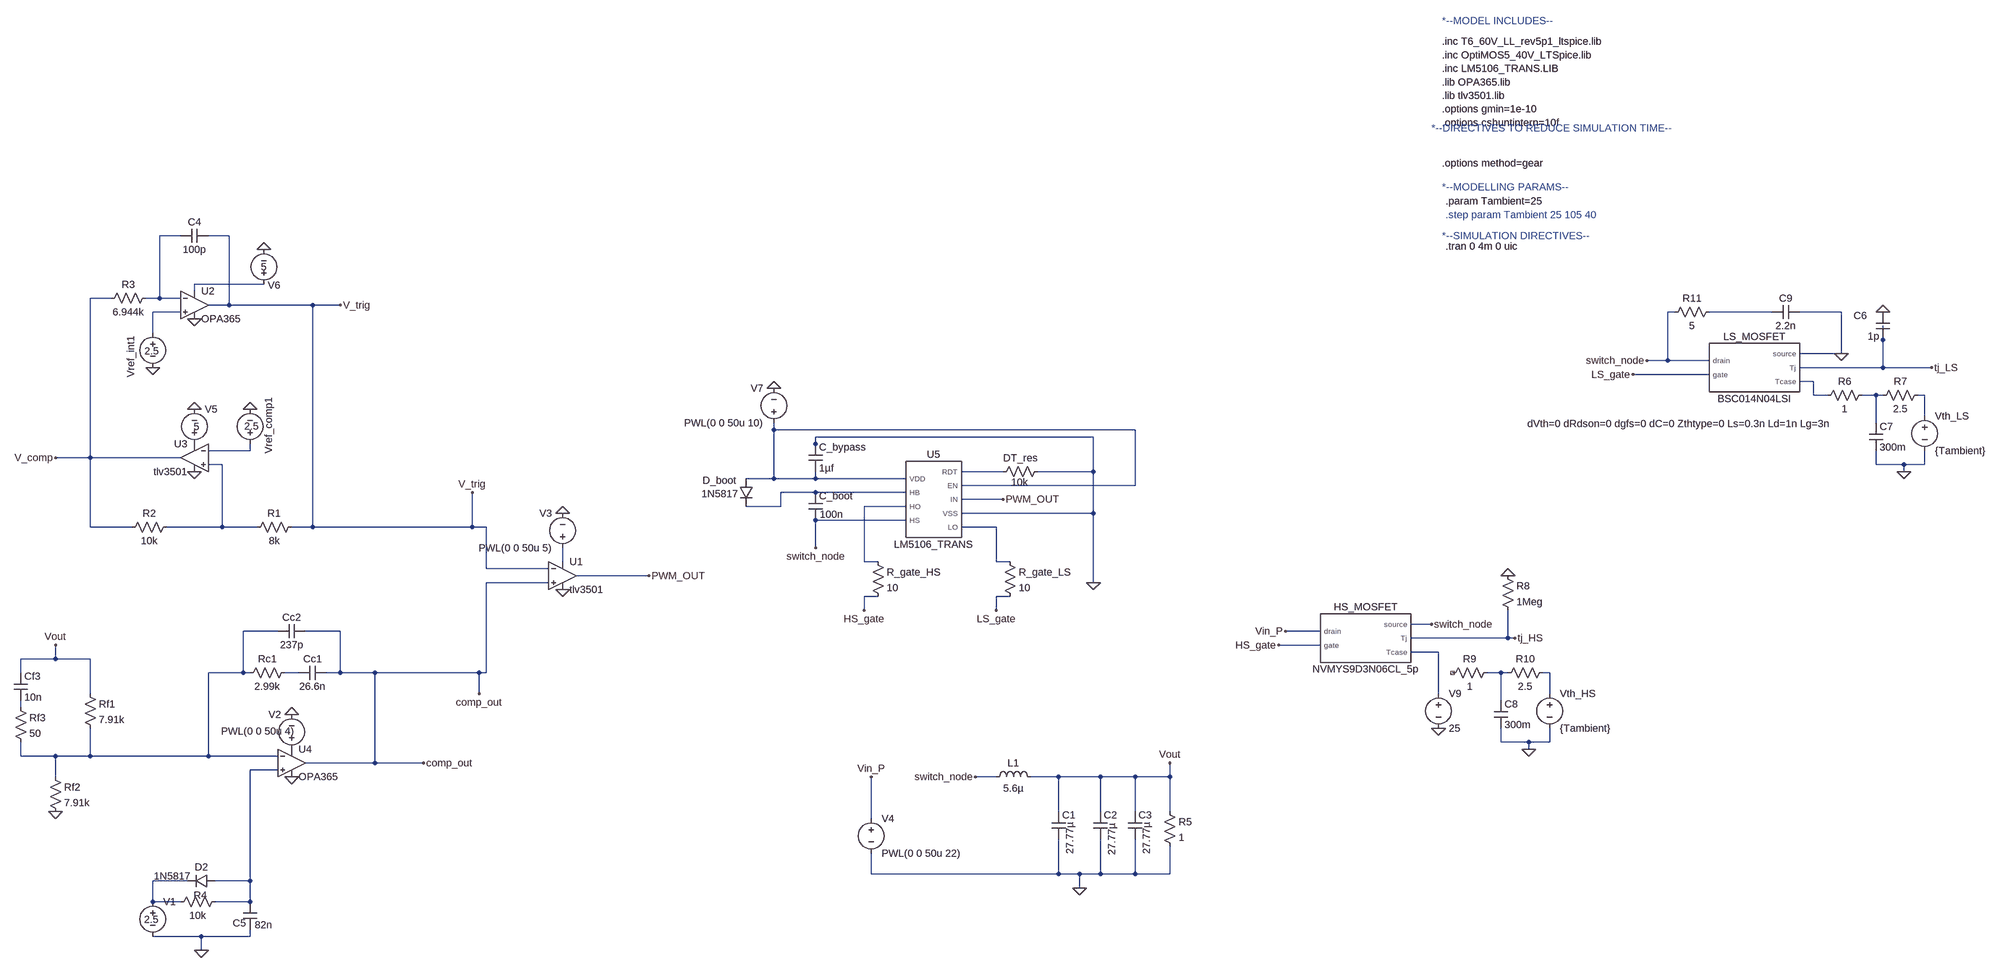
[diagram p0: schematic Full_model.asc]
Full_model.asc, the LTspice schematic file:
Version 4.1
SHEET 1 3588 1124
WIRE -784 -560 -832 -560
WIRE -672 -560 -720 -560
WIRE -592 -448 -752 -448
WIRE -752 -432 -752 -448
WIRE -944 -416 -992 -416
WIRE -832 -416 -832 -560
WIRE -832 -416 -864 -416
WIRE -784 -416 -832 -416
WIRE -672 -400 -672 -560
WIRE -672 -400 -720 -400
WIRE -480 -400 -672 -400
WIRE -416 -400 -480 -400
WIRE -784 -384 -848 -384
WIRE 2848 -384 2832 -384
WIRE 3072 -384 2928 -384
WIRE 3232 -384 3136 -384
WIRE -848 -336 -848 -384
WIRE 3328 -320 3328 -352
WIRE 3232 -288 3232 -384
WIRE 3232 -288 3136 -288
WIRE 2832 -272 2832 -384
WIRE 2832 -272 2784 -272
WIRE 2928 -272 2832 -272
WIRE 3328 -256 3328 -320
WIRE 3328 -256 3136 -256
WIRE 3440 -256 3328 -256
WIRE 2928 -240 2752 -240
WIRE 3168 -224 3136 -224
WIRE 3168 -192 3168 -224
WIRE 3200 -192 3168 -192
WIRE 3312 -192 3280 -192
WIRE 3328 -192 3312 -192
WIRE 3424 -192 3408 -192
WIRE 3424 -144 3424 -192
WIRE 3312 -128 3312 -192
WIRE 608 -112 608 -128
WIRE 1440 -112 608 -112
WIRE 1344 -96 704 -96
WIRE 704 -80 704 -96
WIRE -624 -64 -624 -80
WIRE -624 -64 -720 -64
WIRE 704 -64 704 -80
WIRE -992 -48 -992 -416
WIRE -992 -48 -1072 -48
WIRE -784 -48 -992 -48
WIRE -688 -32 -720 -32
WIRE 3312 -32 3312 -64
WIRE 3376 -32 3312 -32
WIRE 3424 -32 3424 -64
WIRE 3424 -32 3376 -32
WIRE 1136 -16 1040 -16
WIRE 1344 -16 1344 -96
WIRE 1344 -16 1216 -16
WIRE 3376 -16 3376 -32
WIRE 608 0 608 -112
WIRE 608 0 544 0
WIRE 704 0 704 -16
WIRE 704 0 608 0
WIRE 912 0 704 0
WIRE 1440 16 1440 -112
WIRE 1440 16 1040 16
WIRE 704 32 624 32
WIRE 912 32 704 32
WIRE 1136 48 1040 48
WIRE 624 64 624 32
WIRE 624 64 544 64
WIRE 912 64 816 64
WIRE 1344 80 1344 -16
WIRE 1344 80 1040 80
WIRE 912 96 704 96
WIRE -992 112 -992 -48
WIRE -896 112 -992 112
WIRE -688 112 -688 -32
WIRE -688 112 -816 112
WIRE -608 112 -688 112
WIRE -480 112 -480 -400
WIRE -480 112 -528 112
WIRE -112 112 -112 32
WIRE -112 112 -480 112
WIRE -80 112 -112 112
WIRE 1120 112 1040 112
WIRE 704 160 704 96
WIRE 96 192 96 160
WIRE 816 192 816 64
WIRE 848 192 816 192
WIRE 1120 192 1120 112
WIRE 1152 192 1120 192
WIRE -80 208 -80 112
WIRE 64 208 -80 208
WIRE 320 224 128 224
WIRE 64 240 -80 240
WIRE 1344 240 1344 80
WIRE 848 272 816 272
WIRE 1152 272 1120 272
WIRE 816 304 816 272
WIRE 1120 304 1120 272
WIRE 2288 336 2240 336
WIRE -560 352 -640 352
WIRE -416 352 -496 352
WIRE 2032 352 1952 352
WIRE 2464 368 2464 304
WIRE 2464 368 2240 368
WIRE 2480 368 2464 368
WIRE 2032 384 1936 384
WIRE 2304 400 2240 400
WIRE -1072 416 -1072 384
WIRE -1072 416 -1152 416
WIRE -992 416 -1072 416
WIRE -1152 448 -1152 416
WIRE -640 448 -640 352
WIRE -640 448 -720 448
WIRE -624 448 -640 448
WIRE -512 448 -544 448
WIRE -416 448 -416 352
WIRE -416 448 -448 448
WIRE -336 448 -416 448
WIRE -96 448 -336 448
WIRE -80 448 -80 240
WIRE -80 448 -96 448
WIRE 2448 448 2416 448
WIRE 2464 448 2448 448
WIRE 2560 448 2544 448
WIRE -992 496 -992 416
WIRE -96 496 -96 448
WIRE 2304 496 2304 400
WIRE 2560 496 2560 448
WIRE 2448 512 2448 448
WIRE -1152 528 -1152 512
WIRE 2448 608 2448 576
WIRE 2512 608 2448 608
WIRE 2560 608 2560 576
WIRE 2560 608 2512 608
WIRE 2512 624 2512 608
WIRE -1152 640 -1152 608
WIRE -1072 640 -1152 640
WIRE -992 640 -992 576
WIRE -992 640 -1072 640
WIRE -720 640 -720 448
WIRE -720 640 -992 640
WIRE -560 640 -720 640
WIRE -336 656 -336 448
WIRE -336 656 -496 656
WIRE -224 656 -336 656
WIRE -560 672 -624 672
WIRE -1072 688 -1072 640
WIRE 1120 688 1072 688
WIRE 1264 688 1200 688
WIRE 1360 688 1264 688
WIRE 1440 688 1360 688
WIRE 1520 688 1520 656
WIRE 1520 688 1440 688
WIRE 1264 768 1264 688
WIRE 1360 768 1360 688
WIRE 1440 768 1440 688
WIRE 1520 768 1520 688
WIRE 832 784 832 688
WIRE 832 912 832 864
WIRE 1264 912 1264 832
WIRE 1264 912 832 912
WIRE 1312 912 1264 912
WIRE 1360 912 1360 832
WIRE 1360 912 1312 912
WIRE 1440 912 1440 832
WIRE 1440 912 1360 912
WIRE 1520 912 1520 848
WIRE 1520 912 1440 912
WIRE -768 928 -848 928
WIRE -624 928 -624 672
WIRE -624 928 -704 928
WIRE 1312 944 1312 912
WIRE -848 976 -848 928
WIRE -784 976 -848 976
WIRE -624 976 -624 928
WIRE -624 976 -704 976
WIRE -736 1056 -848 1056
WIRE -624 1056 -624 1040
WIRE -624 1056 -736 1056
WIRE -736 1088 -736 1056
FLAG 1312 944 0
FLAG -1072 768 0
FLAG -528 544 0
FLAG -528 688 0
FLAG -224 656 comp_out
FLAG 1520 656 Vout
FLAG 96 256 0
FLAG -96 496 comp_out
FLAG 96 80 0
FLAG -752 -160 0
FLAG -592 -528 0
FLAG -752 -16 0
FLAG -624 -160 0
FLAG -848 -256 0
FLAG -416 -400 V_trig
FLAG -1072 -48 V_comp
FLAG -752 -368 0
FLAG -112 32 V_trig
FLAG -1072 384 Vout
FLAG -736 1088 0
FLAG 608 -208 0
FLAG 320 224 PWM_OUT
FLAG 1136 48 PWM_OUT
FLAG 1344 240 0
FLAG 816 304 HS_gate
FLAG 1120 304 LS_gate
FLAG 704 160 switch_node
FLAG 2480 368 tj_HS
FLAG 3440 -256 tj_LS
FLAG 3328 -384 0
FLAG 3376 -16 0
FLAG 2784 -272 switch_node
FLAG 2752 -240 LS_gate
FLAG 2288 336 switch_node
FLAG 1952 352 Vin_P
FLAG 1936 384 HS_gate
FLAG 2464 224 0
FLAG 2512 624 0
FLAG 832 688 Vin_P
FLAG 1072 688 switch_node
FLAG 2304 576 0
FLAG 3232 -288 0
SYMBOL cap 1248 768 R0
WINDOW 3 42 24 VRight 2
SYMATTR Value 27.77µ
SYMATTR InstName C1
SYMATTR SpiceLine V=25 Rser=2.94m Lser=0.6n
SYMBOL ind 1104 704 R270
WINDOW 0 32 56 VTop 2
WINDOW 3 5 56 VBottom 2
SYMATTR InstName L1
SYMATTR Value 5.6µ
SYMATTR SpiceLine Rser=1m
SYMBOL voltage -848 960 R0
WINDOW 123 0 0 Left 0
WINDOW 39 0 0 Left 0
WINDOW 3 -20 57 Left 2
SYMATTR Value 2.5
SYMATTR InstName V1
SYMBOL res -1008 480 R0
SYMATTR InstName Rf1
SYMATTR Value 7.91k
SYMBOL res -1168 512 R0
SYMATTR InstName Rf3
SYMATTR Value 50
SYMBOL cap -1168 448 R0
SYMATTR InstName Cf3
SYMATTR Value 10n
SYMBOL res -528 432 R90
WINDOW 0 0 56 VBottom 2
WINDOW 3 32 56 VTop 2
SYMATTR InstName Rc1
SYMATTR Value 2.99k
SYMBOL cap -496 336 R90
WINDOW 0 0 32 VBottom 2
WINDOW 3 32 32 VTop 2
SYMATTR InstName Cc2
SYMATTR Value 237p
SYMBOL res -1088 672 R0
SYMATTR InstName Rf2
SYMATTR Value 7.91k
SYMBOL voltage -528 640 R180
WINDOW 0 24 96 Left 2
WINDOW 3 -7 57 Left 2
WINDOW 123 0 0 Left 0
WINDOW 39 0 0 Left 0
SYMATTR InstName V2
SYMATTR Value PWL(0 0 50u 4)
SYMBOL cap -448 432 R90
WINDOW 0 0 32 VBottom 2
WINDOW 3 32 32 VTop 2
SYMATTR InstName Cc1
SYMATTR Value 26.6n
SYMBOL cap 1344 768 R0
WINDOW 3 43 26 VRight 2
SYMATTR Value 27.77µ
SYMATTR InstName C2
SYMATTR SpiceLine V=25 Rser=2.94m Lser=0.6n
SYMBOL cap 1424 768 R0
WINDOW 3 43 24 VRight 2
SYMATTR Value 27.77µ
SYMATTR InstName C3
SYMATTR SpiceLine V=25 Rser=2.94m Lser=0.6n
SYMBOL OpAmps\\opamp2 96 160 R0
SYMATTR InstName U1
SYMATTR Value tlv3501
SYMBOL voltage 96 176 R180
WINDOW 0 24 96 Left 2
WINDOW 3 24 16 Left 2
WINDOW 123 0 0 Left 0
WINDOW 39 0 0 Left 0
SYMATTR InstName V3
SYMATTR Value PWL(0 0 50u 5)
SYMBOL voltage 832 768 R0
WINDOW 123 0 0 Left 0
WINDOW 39 0 0 Left 0
SYMATTR InstName V4
SYMATTR Value PWL(0 0 50u 22)
SYMBOL voltage -752 -64 M180
WINDOW 0 24 96 Left 2
WINDOW 3 -2 56 Left 2
WINDOW 123 0 0 Left 0
WINDOW 39 0 0 Left 0
SYMATTR InstName V5
SYMATTR Value 5
SYMBOL voltage -592 -432 R180
WINDOW 0 -38 14 Left 2
WINDOW 3 -7 56 Left 2
WINDOW 123 0 0 Left 0
WINDOW 39 0 0 Left 0
SYMATTR InstName V6
SYMATTR Value 5
SYMBOL res -512 96 R90
WINDOW 0 0 56 VBottom 2
WINDOW 3 32 56 VTop 2
SYMATTR InstName R1
SYMATTR Value 8k
SYMBOL res -800 96 R90
WINDOW 0 0 56 VBottom 2
WINDOW 3 32 56 VTop 2
SYMATTR InstName R2
SYMATTR Value 10k
SYMBOL res -848 -432 R90
WINDOW 0 0 56 VBottom 2
WINDOW 3 32 56 VTop 2
SYMATTR InstName R3
SYMATTR Value 6.944k
SYMBOL cap -720 -576 R90
WINDOW 0 0 32 VBottom 2
WINDOW 3 32 32 VTop 2
SYMATTR InstName C4
SYMATTR Value 100p
SYMBOL voltage -624 -64 R180
WINDOW 0 -43 -7 VRight 2
WINDOW 3 -21 57 Left 2
WINDOW 123 0 0 Left 0
WINDOW 39 0 0 Left 0
SYMATTR InstName Vref_comp1
SYMATTR Value 2.5
SYMBOL voltage -848 -352 R0
WINDOW 0 -50 22 VRight 2
WINDOW 3 -19 58 Left 2
WINDOW 123 0 0 Left 0
WINDOW 39 0 0 Left 0
SYMATTR InstName Vref_int1
SYMATTR Value 2.5
SYMBOL OpAmps\\opamp2 -752 -464 R0
SYMATTR InstName U2
SYMATTR Value OPA365
SYMBOL OpAmps\\opamp2 -752 -112 M0
SYMATTR InstName U3
SYMATTR Value tlv3501
SYMBOL OpAmps\\opamp2 -528 592 R0
SYMATTR InstName U4
SYMATTR Value OPA365
SYMBOL res -688 960 R90
WINDOW 0 17 50 VBottom 2
WINDOW 3 32 56 VTop 2
SYMATTR InstName R4
SYMATTR Value 10k
SYMBOL cap -640 976 R0
WINDOW 0 -24 49 Left 2
WINDOW 3 27 53 Left 2
SYMATTR InstName C5
SYMATTR Value 82n
SYMBOL diode -704 912 R90
WINDOW 0 0 32 VBottom 2
WINDOW 3 -11 99 VTop 2
SYMATTR InstName D2
SYMATTR Value 1N5817
SYMBOL res 1504 752 R0
SYMATTR InstName R5
SYMATTR Value 1
SYMBOL LM5106_TRANS 976 48 R0
SYMATTR InstName U5
SYMBOL voltage 608 -112 R180
WINDOW 0 24 96 Left 2
WINDOW 3 24 16 Left 2
WINDOW 123 0 0 Left 0
WINDOW 39 0 0 Left 0
SYMATTR InstName V7
SYMATTR Value PWL(0 0 50u 10)
SYMBOL cap 688 32 R0
WINDOW 3 26 51 Left 2
SYMATTR Value 100n
SYMATTR InstName C_boot
SYMBOL cap 688 -80 R0
SYMATTR InstName C_bypass
SYMATTR Value 1µf
SYMBOL res 1232 -32 R90
WINDOW 0 0 56 VBottom 2
WINDOW 3 25 58 VTop 2
SYMATTR InstName DT_res
SYMATTR Value 10k
SYMBOL diode 528 0 R0
WINDOW 0 -84 4 Left 2
WINDOW 3 -87 35 Left 2
SYMATTR InstName D_boot
SYMATTR Value 1N5817
SYMBOL res 832 176 R0
SYMATTR InstName R_gate_HS
SYMATTR Value 10
SYMBOL res 1136 176 R0
SYMATTR InstName R_gate_LS
SYMATTR Value 10
SYMBOL BSC014N04LSI 3024 -256 R0
WINDOW 39 -165 114 Top 2
SYMATTR InstName LS_MOSFET
SYMBOL BSC014N04LSI 2128 368 R0
SYMATTR InstName HS_MOSFET
SYMATTR Value NVMYS9D3N06CL_5p
SYMATTR SpiceLine ""
SYMBOL cap 3344 -320 R180
WINDOW 0 53 56 Left 2
WINDOW 3 24 8 Left 2
SYMATTR InstName C6
SYMATTR Value 1p
SYMBOL res 3296 -208 R90
WINDOW 0 0 56 VBottom 2
WINDOW 3 32 56 VTop 2
SYMATTR InstName R6
SYMATTR Value 1
SYMBOL res 3424 -208 R90
WINDOW 0 0 56 VBottom 2
WINDOW 3 32 56 VTop 2
SYMATTR InstName R7
SYMATTR Value 2.5
SYMBOL voltage 3424 -160 R0
WINDOW 123 0 0 Left 0
WINDOW 39 0 0 Left 0
SYMATTR InstName Vth_LS
SYMATTR Value {Tambient}
SYMBOL cap 3296 -128 R0
SYMATTR InstName C7
SYMATTR Value 300m
SYMBOL res 2448 208 R0
SYMATTR InstName R8
SYMATTR Value 1Meg
SYMBOL res 2432 432 R90
WINDOW 0 0 56 VBottom 2
WINDOW 3 32 56 VTop 2
SYMATTR InstName R9
SYMATTR Value 1
SYMBOL res 2560 432 R90
WINDOW 0 0 56 VBottom 2
WINDOW 3 32 56 VTop 2
SYMATTR InstName R10
SYMATTR Value 2.5
SYMBOL voltage 2560 480 R0
WINDOW 123 0 0 Left 0
WINDOW 39 0 0 Left 0
SYMATTR InstName Vth_HS
SYMATTR Value {Tambient}
SYMBOL cap 2432 512 R0
SYMATTR InstName C8
SYMATTR Value 300m
SYMBOL voltage 2304 480 R0
WINDOW 123 0 0 Left 0
WINDOW 39 0 0 Left 0
SYMATTR InstName V9
SYMATTR Value 25
SYMBOL res 2944 -400 R90
WINDOW 0 0 56 VBottom 2
WINDOW 3 32 56 VTop 2
SYMATTR InstName R11
SYMATTR Value 5
SYMBOL cap 3136 -400 R90
WINDOW 0 0 32 VBottom 2
WINDOW 3 32 32 VTop 2
SYMATTR InstName C9
SYMATTR Value 2.2n
TEXT 2312 -1008 Left 2 !.inc T6_60V_LL_rev5p1_ltspice.lib\n.inc OptiMOS5_40V_LTSpice.lib\n.inc LM5106_TRANS.LIB\n.lib OPA365.lib\n.lib tlv3501.lib \n.options gmin=1e-10\n.options cshuntintern=10f\n \n \n.options method=gear
TEXT 2312 -1056 Left 2 ;*--MODEL INCLUDES--
TEXT 2288 -808 Left 2 ;*--DIRECTIVES TO REDUCE SIMULATION TIME--
TEXT 2312 -672 Left 2 ;*--MODELLING PARAMS--
TEXT 2320 -640 Left 2 !.param Tambient=25
TEXT 2320 -608 Left 2 ;.step param Tambient 25 105 40
TEXT 2312 -560 Left 2 ;*--SIMULATION DIRECTIVES--
TEXT 2320 -536 Left 2 !.tran 0 4m 0 uic

The netlist it stands for:
* Full_model.asc
C1 Vout 0 27.77µ V=25 Rser=2.94m Lser=0.6n
L1 switch_node Vout 5.6µ Rser=1m
V1 N023 0 2.5
Rf1 Vout N016 7.91k
Rf3 N021 N016 50
Cf3 Vout N021 10n
Rc1 N018 N016 2.99k
Cc2 comp_out N016 237p
Rf2 N016 0 7.91k
V2 P001 0 PWL(0 0 50u 4)
Cc1 comp_out N018 26.6n
C2 Vout 0 27.77µ V=25 Rser=2.94m Lser=0.6n
C3 Vout 0 27.77µ V=25 Rser=2.94m Lser=0.6n
X§U1 comp_out V_trig N015 0 PWM_OUT tlv3501  ; pins In+ In- V+ V- OUT
V3 N015 0 PWL(0 0 50u 5)
V4 Vin_P 0 PWL(0 0 50u 22)
V5 P002 0 5
V6 N002 0 5
R1 V_trig N010 8k
R2 N010 V_comp 10k
R3 N001 V_comp 6.944k
C4 V_trig N001 100p
Vref_comp1 N009 0 2.5
Vref_int1 N003 0 2.5
X§U2 N003 N001 N002 0 V_trig OPA365  ; pins In+ In- V+ V- OUT
X§U3 N010 N009 P002 0 V_comp tlv3501  ; pins In+ In- V+ V- OUT
X§U4 N022 N016 P001 0 comp_out OPA365  ; pins In+ In- V+ V- OUT
R4 N022 N023 10k
C5 N022 0 82n
D2 N022 N023 1N5817
R5 Vout 0 1
X§U5 N008 N012 N013 switch_node N011 N008 PWM_OUT 0 N014 LM5106_TRANS  ; pins VDD HB HO HS RDT EN IN VSS LO
V7 N008 0 PWL(0 0 50u 10)
C_boot N012 switch_node 100n
C_bypass 0 N008 1µf
R§DT_res 0 N011 10k
D_boot N008 N012 1N5817
R_gate_HS N013 HS_gate 10
R_gate_LS N014 LS_gate 10
X§LS_MOSFET switch_node LS_gate 0 tj_LS N005 BSC014N04LSI dVth=0 dRdson=0 dgfs=0 dC=0 Zthtype=0 Ls=0.3n Ld=1n Lg=3n  ; pins drain gate source Tj Tcase
X§HS_MOSFET Vin_P HS_gate switch_node tj_HS N017 NVMYS9D3N06CL_5p  ; pins drain gate source Tj Tcase
C6 tj_LS 0 1p
R6 N006 N005 1
R7 N007 N006 2.5
Vth_LS N007 0 {Tambient}
C7 N006 0 300m
R8 0 tj_HS 1Meg
R9 N019 NC_01 1
R10 N020 N019 2.5
Vth_HS N020 0 {Tambient}
C8 N019 0 300m
V9 N017 0 25
R11 N004 switch_node 5
C9 0 N004 2.2n
.model D D
.lib standard.dio
.inc T6_60V_LL_rev5p1_ltspice.lib
.inc OptiMOS5_40V_LTSpice.lib
.inc LM5106_TRANS.LIB
.lib OPA365.lib
.lib tlv3501.lib
.options gmin=1e-10
.options cshuntintern=10f
.options method=gear
* *--MODEL INCLUDES--
* *--DIRECTIVES TO REDUCE SIMULATION TIME--
* *--MODELLING PARAMS--
.param Tambient=25
* .step param Tambient 25 105 40
* *--SIMULATION DIRECTIVES--
.tran 0 4m 0 uic
.lib LM5106_TRANS.LIB
.lib OptiMOS5_40V_LTSpice.lib
.backanno
.end